# EAGLE schematic SubboardWithoutMotorsAndEM (EAGLE 9.6.0)
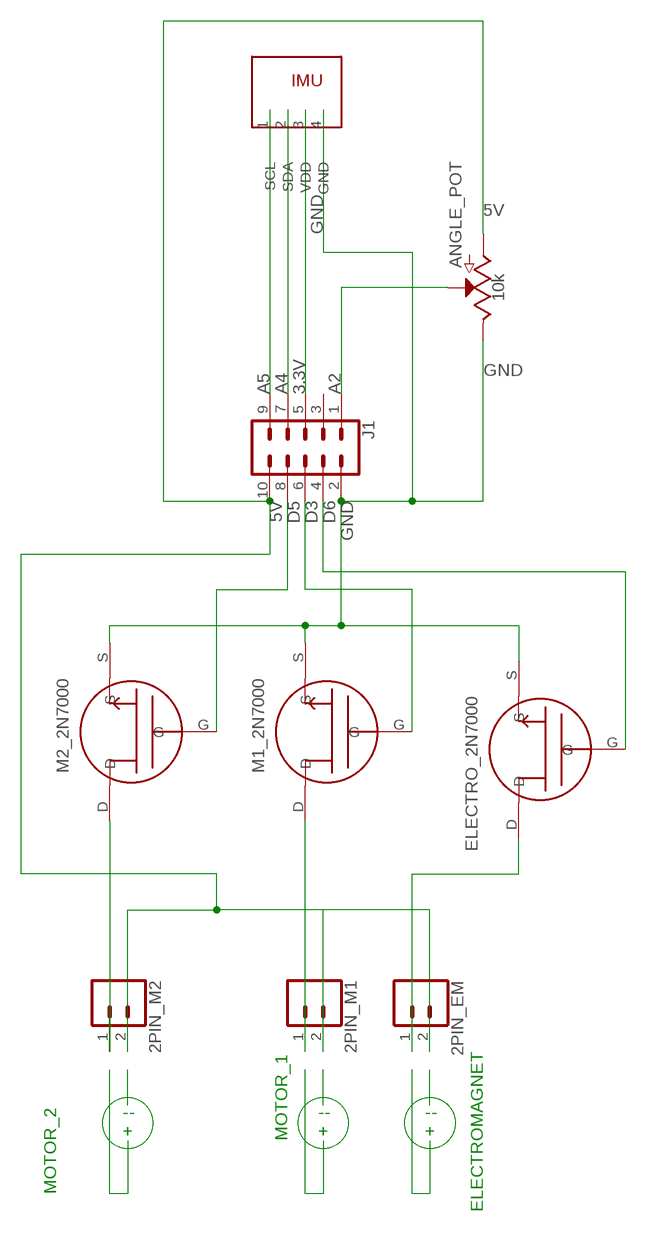
[diagram p0: schematic, sheet 1]

## Parts
2PIN_EM  CONN_02  [1X02]
2PIN_M1  CONN_02  [1X02]
2PIN_M2  CONN_02  [1X02]
ANGLE_POT  10k  POTENTIOMETER-PTH-9MM-1/20W-20%-KIT  [POT-PTH-ALPS-KIT]
ELECTRO_2N7000  2N7000_N_FET  [2N7000_N_FET]
J1  CONN_05X2SHD  [2X5-SHROUDED]
M1_2N7000  2N7000_N_FET  [2N7000_N_FET]
M2_2N7000  2N7000_N_FET  [2N7000_N_FET]
U$1  MPU-9250  [MPU-9250]

## Nets
3.3V: J1.5 U$1.3(VDD)
5V: 2PIN_EM.2 2PIN_M1.2 2PIN_M2.2 ANGLE_POT.P$3(A) J1.10
A2: ANGLE_POT.P$2(S) J1.1
A4: J1.7 U$1.2(SDA)
A5: J1.9 U$1.1(SCL)
D3: J1.6 M1_2N7000.G
D5: J1.8 M2_2N7000.G
D6: ELECTRO_2N7000.G J1.4
GND: ANGLE_POT.P$1(E) ELECTRO_2N7000.S J1.2 M1_2N7000.S M2_2N7000.S U$1.4(GND)
N$1: 2PIN_M2.1 M2_2N7000.D
N$2: 2PIN_M1.1 M1_2N7000.D
N$3: 2PIN_EM.1 ELECTRO_2N7000.D
Unconnected: J1.3

## Notes on the sheet
- --
  +
- --
  +
- --
  +
- MOTOR_1
- MOTOR_2
- ELECTROMAGNET

## Library data of the parts
2PIN_EM 2PIN_M1 2PIN_M2 = SparkFun-Connectors:CONN_02: Multi connection point. Often used as Generic Header-pin footprint for 0.1 inch spaced/style header connections On any of the 0.1 inch spaced packages, you can populate with these: Break Away Headers - Straight <https://www.sparkfun.com/products/116> (PRT-00116) Break Away Male Headers - Right Angle <https://www.sparkfun.com/products/553> (PRT-00553) Female Headers <https://www.sparkfun.com/products/115> (PRT-00115) Break Away Headers - Machine Pin <https://www.sparkfun.com/products/117> (PRT-00117) Break Away Female Headers - Swiss Machine Pin <https://www.sparkfun.com/products/743> (PRT-00743) For SCREWTERMINALS and SPRING TERMINALS visit here: Screw Terimnals on SparkFun.com <https://www.sparkfun.com/search/results?term=Screw+Terminals> (5mm/3.5mm/2.54mm spacing) This device is also useful as a general connection point to wire up your design to another part of your project. Our various solder wires solder well into these plated through hole pads. Hook-Up Wire - Assortment (Stranded, 22 AWG) <https://www.sparkfun.com/products/11375> (PRT-11375) Hook-Up Wire - Assortment (Solid Core, 22 AWG) <https://www.sparkfun.com/products/11367> (PRT-11367) View the entire wire category on our website here <https://www.sparkfun.com/categories/141> Special notes: Molex polarized connector foot print use with: PRT-08233 with associated crimp pins and housings. 2.54_SCREWTERM for use with PRT-10571. 3.5mm Screw Terminal footprints for PRT-08084 5mm Screw Terminal footprints for use with PRT-08432
ANGLE_POT = SparkFun-Resistors:POTENTIOMETER: Potentiometer (Pot) Three-terminal potentiometers, with an adjustable wiper and two adjustable resistors. A pot can be used to create a configurable voltage divider, or as a variable resistor. Variants ALPS_POT and ALPS_POT_KIT - PTH, breadboard compatible, 9mm square pots Rotary Potentiometer - Linear (10k ohm) <https://www.sparkfun.com/products/9288> (COM-09288) The KIT variant exposes copper on only one side of the PTH pad, so the part can only be assembled on one side of the PCB. Useful for beginner soldering kits.; PROD_ID: RES-09177; SF_SKU: COM-09288
ELECTRO_2N7000 M1_2N7000 M2_2N7000 = ChopstixComponents:2N7000_N_FET
J1 = SparkFun-Connectors:CONN_05X2: Multi connection point. Often used as Generic Header-pin footprint for 0.1 inch spaced/style header connections For AVR SPI programming port, see special device with nice symbol: "AVR_SPI_PROG_5x2.dev" You can populate with any combo of single row headers, but if you'd like an exact match, check these: 2x5 AVR ICSP Male Header <https://www.sparkfun.com/products/778> (PRT-00778) 2x5 Pin Shrouded Header <https://www.sparkfun.com/products/8506> (PRT-08506) On any of the 0.1 inch spaced packages, you can populate with these: Break Away Headers - Straight <https://www.sparkfun.com/products/116> (PRT-00116) Break Away Male Headers - Right Angle <https://www.sparkfun.com/products/553> (PRT-00553) Female Headers <https://www.sparkfun.com/products/115> (PRT-00115) Break Away Headers - Machine Pin <https://www.sparkfun.com/products/117> (PRT-00117) Break Away Female Headers - Swiss Machine Pin <https://www.sparkfun.com/products/743> (PRT-00743) Special note: the shrouded connector mates well with our 5x2 ribbon cables: 2x5 Pin IDC Ribbon Cable <https://www.sparkfun.com/products/8535> (PRT-08535); PROD_ID: CONN-08671; SF_ID: PRT-08506
U$1 = ChopstixComponents:MPU-9250